# EAGLE design quadripod_v3Rc (EAGLE 9.3.0)
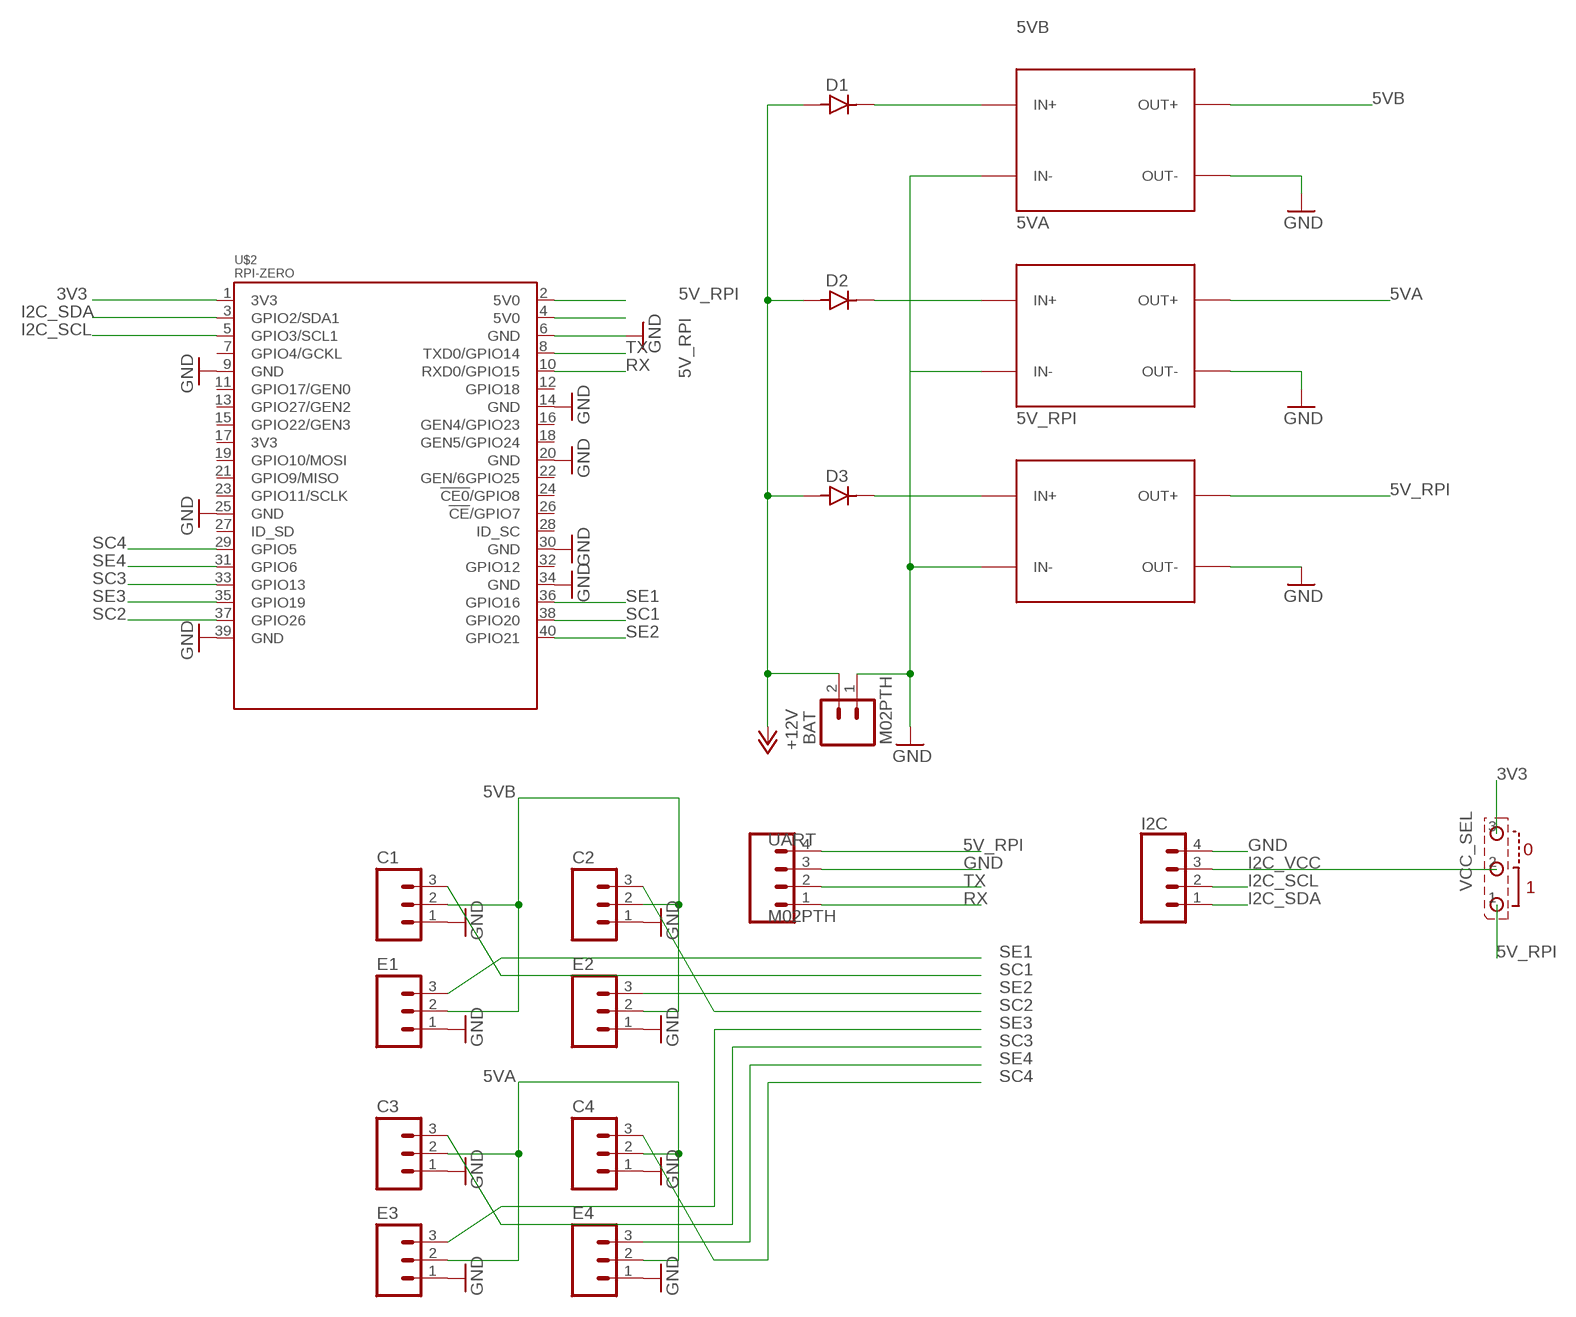
[diagram p0: schematic, sheet 1]

## Parts
5V_RPI  DC-DC-STEP-DOWN-LM2596  [DC-DC-STEP-DOWN-LM2596]
5VA  DC-DC-STEP-DOWN-LM2596  [DC-DC-STEP-DOWN-LM2596]
5VB  DC-DC-STEP-DOWN-LM2596  [DC-DC-STEP-DOWN-LM2596]
BAT  M02PTH  CONN_02PTH3  [1X02_LONGPADS]
C1  M03LONGPADS  [1X03_LONGPADS]
C2  M03LONGPADS  [1X03_LONGPADS]
C3  M03LONGPADS  [1X03_LONGPADS]
C4  M03LONGPADS  [1X03_LONGPADS]
D1  DIODES_DIODE/DO41  [DIODES_DO41]
D2  DIODES_DIODE/DO41  [DIODES_DO41]
D3  DIODES_DIODE/DO41  [DIODES_DO41]
E1  M03LONGPADS  [1X03_LONGPADS]
E2  M03LONGPADS  [1X03_LONGPADS]
E3  M03LONGPADS  [1X03_LONGPADS]
E4  M03LONGPADS  [1X03_LONGPADS]
I2C  CONN_04LONGPADS  [1X04_LONGPADS]
U$2  RPI-ZERO  [RASPBERRYPI_BASTELSTUBE_V13_RASPI_BOARD_B+_FULL]
UART  M02PTH  CONN_04LONGPADS  [1X04_LONGPADS]
VCC_SEL  STCMS_3/CMS  [STCMS_3]

## Nets
3V3 [5V_RPI]: U$2.1(3V3) VCC_SEL.3
5V_RPI [5V_RPI]: 5V_RPI.OUT+ U$2.2(5V0) U$2.4(5V0) UART.4 VCC_SEL.1
5VA [power]: 5VA.OUT+ C3.2 C4.2 E3.2 E4.2
5VB: 5VB.OUT+ C1.2 C2.2 E1.2 E2.2
+12V [power]: BAT.2 D1.A D2.A D3.A
GND [power]: 5V_RPI.IN- 5V_RPI.OUT- 5VA.IN- 5VA.OUT- 5VB.IN- 5VB.OUT- BAT.1 C1.1 C2.1 C3.1 C4.1 E1.1 E2.1 E3.1 E4.1 I2C.4 U$2.6(GND) U$2.9(GND) U$2.14(GND) U$2.20(GND) U$2.25(GND) U$2.30(GND) U$2.34(GND) U$2.39(GND) UART.3
I2C_SCL: I2C.2 U$2.5(GPIO3/SCL1)
I2C_SDA: I2C.1 U$2.3(GPIO2/SDA1)
I2C_VCC [5V_RPI]: I2C.3 VCC_SEL.2
N$1: 5VB.IN+ D1.K
N$2: 5V_RPI.IN+ D3.K
N$3: 5VA.IN+ D2.K
RX: U$2.10(RXD0/GPIO15) UART.1
SC1: C1.3 U$2.38(GPIO20)
SC2: C2.3 U$2.37(GPIO26)
SC3: C3.3 U$2.33(GPIO13)
SC4: C4.3 U$2.29(GPIO5)
SE1: E1.3 U$2.36(GPIO16)
SE2: E2.3 U$2.40(GPIO21)
SE3: E3.3 U$2.35(GPIO19)
SE4: E4.3 U$2.31(GPIO6)
TX: U$2.8(TXD0/GPIO14) UART.2
Unconnected: U$2.7(GPIO4/GCKL) U$2.11(GPIO17/GEN0) U$2.12(GPIO18) U$2.13(GPIO27/GEN2) U$2.15(GPIO22/GEN3) U$2.16(GEN4/GPIO23) U$2.17(3V3) U$2.18(GEN5/GPIO24) U$2.19(GPIO10/MOSI) U$2.21(GPIO9/MISO) U$2.22(GEN/6GPIO25) U$2.23(GPIO11/SCLK) U$2.24(!CE0!/GPIO8) U$2.26(!CE!/GPIO7) U$2.27(ID_SD) U$2.28(ID_SC) U$2.32(GPIO12)

## Library data of the parts
5V_RPI 5VA 5VB = diy-modules:DC-DC-STEP-DOWN-LM2596: DC/DC Step-Down Regulator based on LM2596-ADJ chip LM2596 datasheet available here: http://www.ti.com/lit/ds/symlink/lm2596.pdf Click here to find device on ebay.com <http://www.ebay.com/sch/lm2596+power+regulator>
BAT = SparkFun-Connectors:CONN_02: Multi connection point. Often used as Generic Header-pin footprint for 0.1 inch spaced/style header connections On any of the 0.1 inch spaced packages, you can populate with these: Break Away Headers - Straight <https://www.sparkfun.com/products/116> (PRT-00116) Break Away Male Headers - Right Angle <https://www.sparkfun.com/products/553> (PRT-00553) Female Headers <https://www.sparkfun.com/products/115> (PRT-00115) Break Away Headers - Machine Pin <https://www.sparkfun.com/products/117> (PRT-00117) Break Away Female Headers - Swiss Machine Pin <https://www.sparkfun.com/products/743> (PRT-00743) For SCREWTERMINALS and SPRING TERMINALS visit here: Screw Terimnals on SparkFun.com <https://www.sparkfun.com/search/results?term=Screw+Terminals> (5mm/3.5mm/2.54mm spacing) This device is also useful as a general connection point to wire up your design to another part of your project. Our various solder wires solder well into these plated through hole pads. Hook-Up Wire - Assortment (Stranded, 22 AWG) <https://www.sparkfun.com/products/11375> (PRT-11375) Hook-Up Wire - Assortment (Solid Core, 22 AWG) <https://www.sparkfun.com/products/11367> (PRT-11367) View the entire wire category on our website here <https://www.sparkfun.com/categories/141> Special notes: Molex polarized connector foot print use with: PRT-08233 with associated crimp pins and housings. 2.54_SCREWTERM for use with PRT-10571. 3.5mm Screw Terminal footprints for PRT-08084 5mm Screw Terminal footprints for use with PRT-08432
C1-C4 E1-E4 = 7robot:M03: Header 3 Standard 3-pin 0.1" header. Use with straight break away headers (SKU : PRT-00116), right angle break away headers (PRT-00553), swiss pins (PRT-00743), machine pins (PRT-00117), and female headers (PRT-00115). Molex polarized connector foot print use with SKU : PRT-08232 with associated crimp pins and housings.
D1-D3 = 7robot:DIODES_DIODE: BAS32L => SOD80
I2C UART = SparkFun-Connectors:CONN_04: Multi connection point. Often used as Generic Header-pin footprint for 0.1 inch spaced/style header connections On any of the 0.1 inch spaced packages, you can populate with these: Break Away Headers - Straight <https://www.sparkfun.com/products/116> (PRT-00116) Break Away Male Headers - Right Angle <https://www.sparkfun.com/products/553> (PRT-00553) Female Headers <https://www.sparkfun.com/products/115> (PRT-00115) Break Away Headers - Machine Pin <https://www.sparkfun.com/products/117> (PRT-00117) Break Away Female Headers - Swiss Machine Pin <https://www.sparkfun.com/products/743> (PRT-00743) For SCREWTERMINALS and SPRING TERMINALS visit here: Screw Terimnals on SparkFun.com <https://www.sparkfun.com/search/results?term=Screw+Terminals> (5mm/3.5mm/2.54mm spacing) This device is also useful as a general connection point to wire up your design to another part of your project. Our various solder wires solder well into these plated through hole pads. Hook-Up Wire - Assortment (Stranded, 22 AWG) <https://www.sparkfun.com/products/11375> (PRT-11375) Hook-Up Wire - Assortment (Solid Core, 22 AWG) <https://www.sparkfun.com/products/11367> (PRT-11367) View the entire wire category on our website here <https://www.sparkfun.com/categories/141> Special notes: Molex polarized connector foot print use with SKU : PRT-08231 with associated crimp pins and housings. 1MM SMD Version SKU: PRT-10208; PROD_ID: CONN-09696
U$2 = RPI-Zero:RPI-ZERO
VCC_SEL = 7robot:STCMS_3

## Net classes
0 default: width 0.5 mm, drill 0.2 mm, clearance 0.25 mm
1 power: width 1 mm, drill 0.5 mm, clearance 0.5 mm
2 5V_RPI: width 1 mm, drill 0.5 mm, clearance 0.35 mm
3 signal: width 0.15 mm, drill 0.3 mm, clearance 0.006 mm

## Board
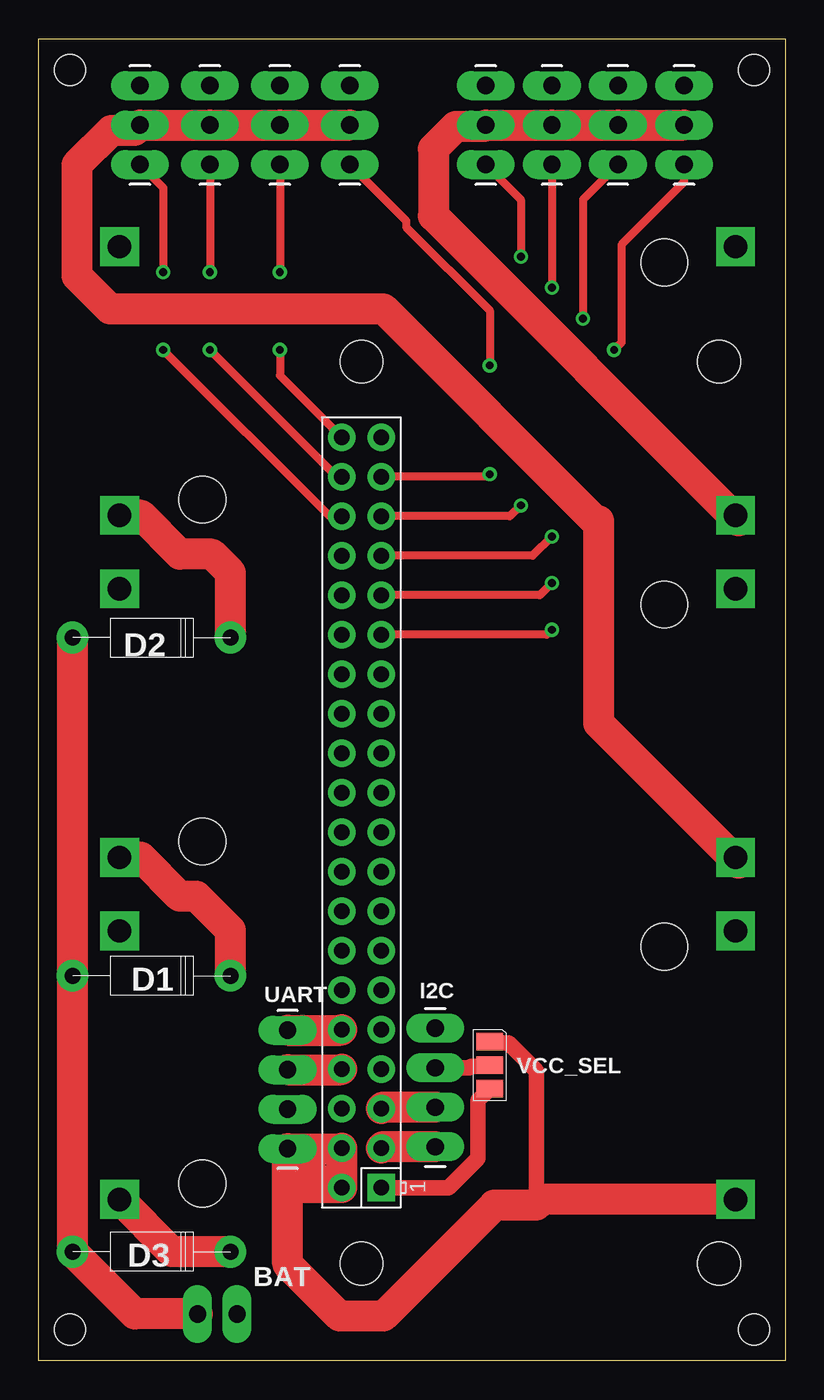
[diagram p1: board, top side]
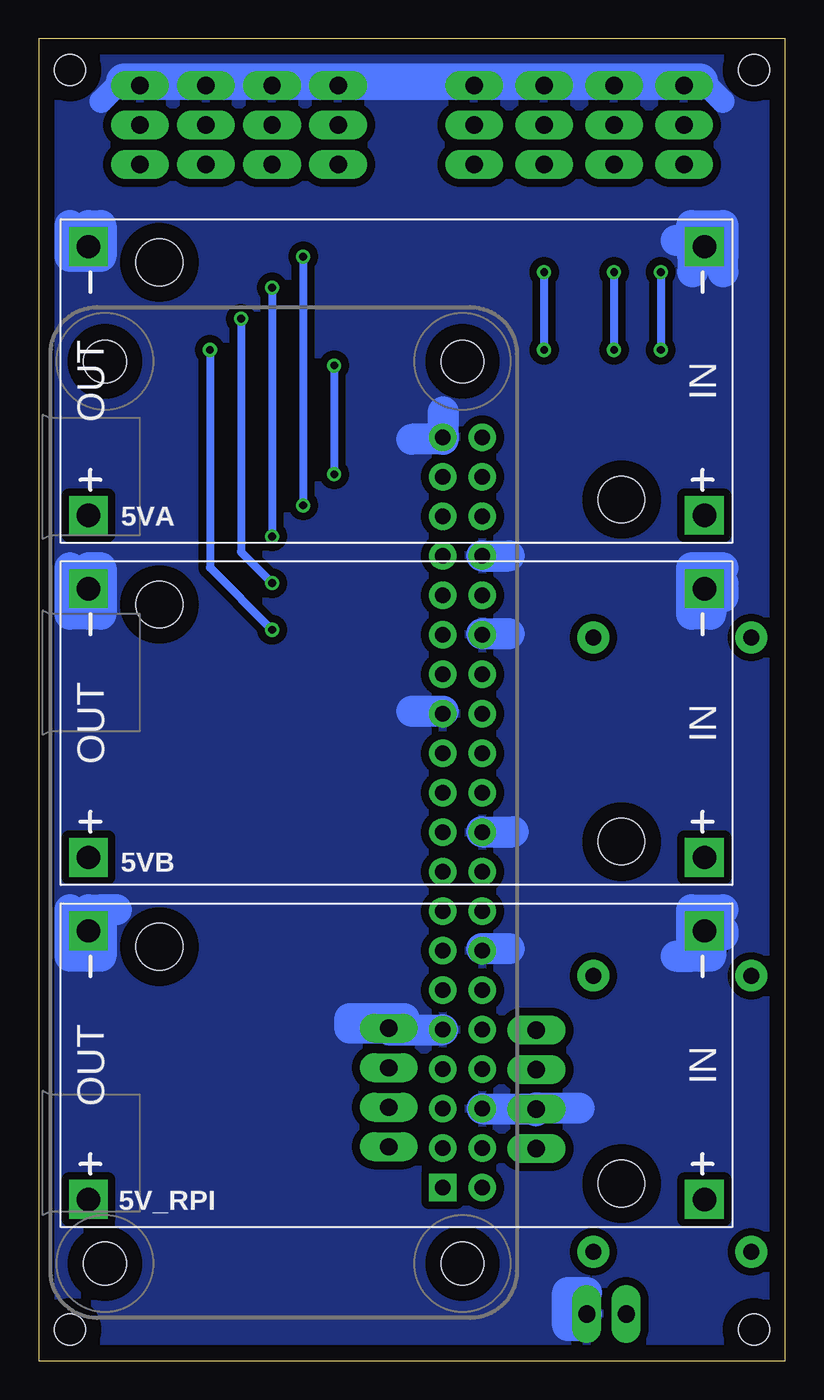
[diagram p2: board, bottom side, seen from below]

Size 48 x 85 mm. Coordinates in mm from the lower left corner, seen from the top.
Outline: 0,0 0,85 48,85 48,0 0,0
Copper layers (1*16): Top 0.035mm / dielectric 1.5mm / Bottom 0.035mm
Design rules "default": minimum track width 6mil, minimum drill 0.35mm, track to track 6mil, track to pad 6mil, pad to pad 6mil, via to via 6mil, smd to smd 6mil, copper to edge 40mil, drill to drill 6mil, minimum pad ring 10mil, minimum via ring 8mil, stop-mask expansion 4mil, vias tented up to drill 0mil, thermal gap 10mil
Holes 2 mm at 2,83 46,83 2,2 46,2

### Footprints (pad centres in the part's own frame; a part is rotated, then mirrored left to right if it is on the bottom)
DC-DC-STEP-DOWN-LM2596 = drill 1.5 pad 2.5 square: IN+ -19.812,8.636; IN- -19.812,-8.636; OUT+ 19.812,8.636; OUT- 19.812,-8.636 | hole 3: -14.478,7.62; 15.24,-7.62
1X02_LONGPADS = drill 1.118 pad 1.88 long: 1 0,0; 2 2.54,0
1X03_LONGPADS = drill 1.118 pad 1.88 long: 1 0,0; 2 2.54,0; 3 5.08,0
DIODES_DO41 = drill 1.016 pad 2.032: A 5.08,0; K -5.08,0
1X04_LONGPADS = drill 1.118 pad 1.88 long: 1 0,0; 2 2.54,0; 3 5.08,0; 4 7.62,0
RASPBERRYPI_BASTELSTUBE_V13_RASPI_BOARD_B+_FULL = drill 1 pad 1.778 square: 1 8.37,25.23 | drill 1 pad 1.778: 2 8.37,27.77; 3 10.91,25.23; 4 10.91,27.77; 5 13.45,25.23; 6 13.45,27.77; 7 15.99,25.23; 8 15.99,27.77; 9 18.53,25.23; 10 18.53,27.77; 11 21.07,25.23; 12 21.07,27.77; 13 23.61,25.23; 14 23.61,27.77; 15 26.15,25.23; 16 26.15,27.77; 17 28.69,25.23; 18 28.69,27.77; 19 31.23,25.23; 20 31.23,27.77; 21 33.77,25.23; 22 33.77,27.77; 23 36.31,25.23; 24 36.31,27.77; 25 38.85,25.23; 26 38.85,27.77; 27 41.39,25.23; 28 41.39,27.77; 29 43.93,25.23; 30 43.93,27.77; 31 46.47,25.23; 32 46.47,27.77; 33 49.01,25.23; 34 49.01,27.77; 35 51.55,25.23; 36 51.55,27.77; 37 54.09,25.23; 38 54.09,27.77; 39 56.63,25.23; 40 56.63,27.77 | hole 2.75: 3.5,3.5; 3.5,26.5; 61.5,3.5; 61.5,26.5
STCMS_3 = smd 1.727 x 1.143: 1 0,-1.508; 2 0,0; 3 0,1.508

### Placement (x,y rotation side)
5V_RPI  25,19 180 bottom
5VA  25,63 180 bottom
5VB  25,41 180 bottom
BAT  12.75,3 0 bottom
C1  11,82 270 top
C2  20,82 270 top
C3  33,82 270 top
C4  41.5,82 270 top
D1  7.25,24.75 180 top
D2  7.25,46.5 180 top
D3  7.25,7 180 top
E1  6.5,82 270 top
E2  15.5,82 270 top
E3  28.75,82 270 top
E4  37.25,82 270 top
I2C  25.5,13.75 90 top
U$2  47.25,2.75 90 top
UART  16,21.25 270 top
VCC_SEL  29,19 180 top

### Tracks (layer width: path | path; a pad name or v marks a point on that pad's centre or on a via)
3V3
  Top 1: VCC_SEL.3 28.23,16.72 28.23,13.01 26.34,11.12 U$2.1
5V_RPI
  Top 1: VCC_SEL.1 29.09,20.42 30.22,20.42 32,18.64 32,10
  Top 2: UART.4 19.45,13.63 U$2.4 U$2.2 | U$2.2 18.51,11.12 UART.4 | 5V_RPI.OUT+ 32.36,10.36 32,10 29.3,10 22.16,2.86 19.34,2.86 16,6.2 16,11 | 16,11 UART.4 | U$2.2 16.12,11.12 16,11
5VA
  Top 2: C4.2 E4.2 C3.2 E3.2 28.65,79.36 26.8,79.36 25.37,77.93 25.37,73.63 45,54 45,54.18 5VA.OUT+
5VB
  Top 2: C2.2 E2.2 C1.2 E1.2 6.15,79.11 4.65,79.11 2.44,76.89 2.44,72 2.44,71 2.44,69.77 4.56,67.64 22.16,67.64 35.8,54 36,54 36,41 45,32 45,32.18 5VB.OUT+
+12V
  Top 2: D2.A D1.A D3.A 6.17,3 BAT.2
GND
  Bottom 1.5: 5,82 7,82 | 44,81 43,82 C4.1 | 5.5,82.25 5.25,82.25 | 5.25,82.25 5,82 | 5,82 4,81 | E1.1 5.25,82.25
  Bottom 2: 22,61 22,59.25 24,59.25 | 19.5,26.5 17.75,26.5 | 19.5,34 17.5,34 | 22,41.75 24,41.75 | 19.5,46.75 17.75,46.75 | 19.5,51.75 17.75,51.75 | U$2.6 16.2,16.2 16.07,16.07 16,16.07 | 16,16.25 13.25,16.25 | U$2.9 25.5,21.28 I2C.4 28,21.37 28,22 24.51,22 | 5V_RPI.OUT- 44.81,29 44,29 | 43,29 44,29 | 44,29 44,26 45.98,26 45.98,29 | BAT.1 13,3 13,2.25 14,2.25 14,4.38 12.75,4.38 | 5V_RPI.IN- 4,27.64 4,27.37 4.79,27.37 4.79,26 6,26 | 7,26 6,26 | 6,26 6,29 4,29 | 5VB.IN- 4,49.64 | 4,49.64 4,50 | 4,49.64 4,49.12 4.79,49.12 4.79,48 6,48 6,51 4,51 | 5VA.IN- 5.95,71.64 5.95,72.06 6,72.06 | 7,72.06 6,72.06 | 6,72.06 6,73 4,73 4,71 | 4,70 4,71 | 4,71 5.95,71 5.95,70 | 5VA.OUT- 44.81,73 44,73 44,71 45.98,71 45.98,73 | 5VB.OUT- 44.81,51 44,51 44,48 45.98,48 45.98,51
  Bottom 2.35: 5.5,82.25 42.5,82.25
  Bottom 3: 44.75,50.25 44.75,48.5
  pour Bottom: -2,-2 -2,87 50,87 50,-2
I2C_SCL
  Top 2: I2C.2 22.11,16.29 U$2.5
I2C_SDA
  Top 2: I2C.1 22.11,13.75 U$2.3
I2C_VCC
  Top 1: VCC_SEL.2 28.91,18.91 27.78,18.91 27.7,18.83 I2C.3
N$1
  Top 2: D1.K 12.33,27.67 10.14,29.86 9.07,29.86 6.57,32.36 5VB.IN+
N$2
  Top 2: D3.K 8.55,7 5V_RPI.IN+
N$3
  Top 2: D2.K 12.33,50.67 11.14,51.86 9.07,51.86 6.57,54.36 5VA.IN+
RX
  Top 2: UART.1 19.45,21.25 U$2.10
SC1  (via drill 0.5)
  Top 0.5: C1.3 v11,70 | v11,65 19.16,56.84 U$2.38
  Bottom 0.5: v11,70 v11,65
SC2  (via drill 0.5)
  Top 0.5: C2.3 23.62,73.3 23.62,72.91 29,67.53 v29,64 | v29,57 28.84,56.84 U$2.37
  Bottom 0.5: v29,64 v29,57
SC3  (via drill 0.5)
  Top 0.5: C3.3 v33,69 | v33,53 31.76,51.76 U$2.33
  Bottom 0.5: v33,69 v33,53
SC4  (via drill 0.5)
  Top 0.5: C4.3 41.5,75.79 37.47,71.77 37.47,65.47 v37,65 | v33,47 32.68,46.68 U$2.29
  Bottom 0.5: v37,65 37,51 v33,47
SE1  (via drill 0.5)
  Top 0.5: E1.3 8,75.42 v8,70 | v8,65 18.7,54.3 U$2.36
  Bottom 0.5: v8,70 v8,65
SE2  (via drill 0.5)
  Top 0.5: E2.3 v15.5,70 | v15.5,65 15.5,63.36 U$2.40
  Bottom 0.5: v15.5,70 v15.5,65
SE3  (via drill 0.5)
  Top 0.5: E3.3 31,74.67 v31,71 | v31,55 30.3,54.3 U$2.35
  Bottom 0.5: v31,71 v31,55
SE4  (via drill 0.5)
  Top 0.5: E4.3 35,74.67 v35,67 | v33,50 32.22,49.22 U$2.31
  Bottom 0.5: v35,67 35,52 v33,50
TX
  Top 2: UART.2 19.45,18.71 U$2.8

### Text on the board
tDocu: Rx | 5v | Tx | gnd | 3.3v | SCL | 5v | SDA | Thib-s / v3.0 Rev C | gnd | Vin